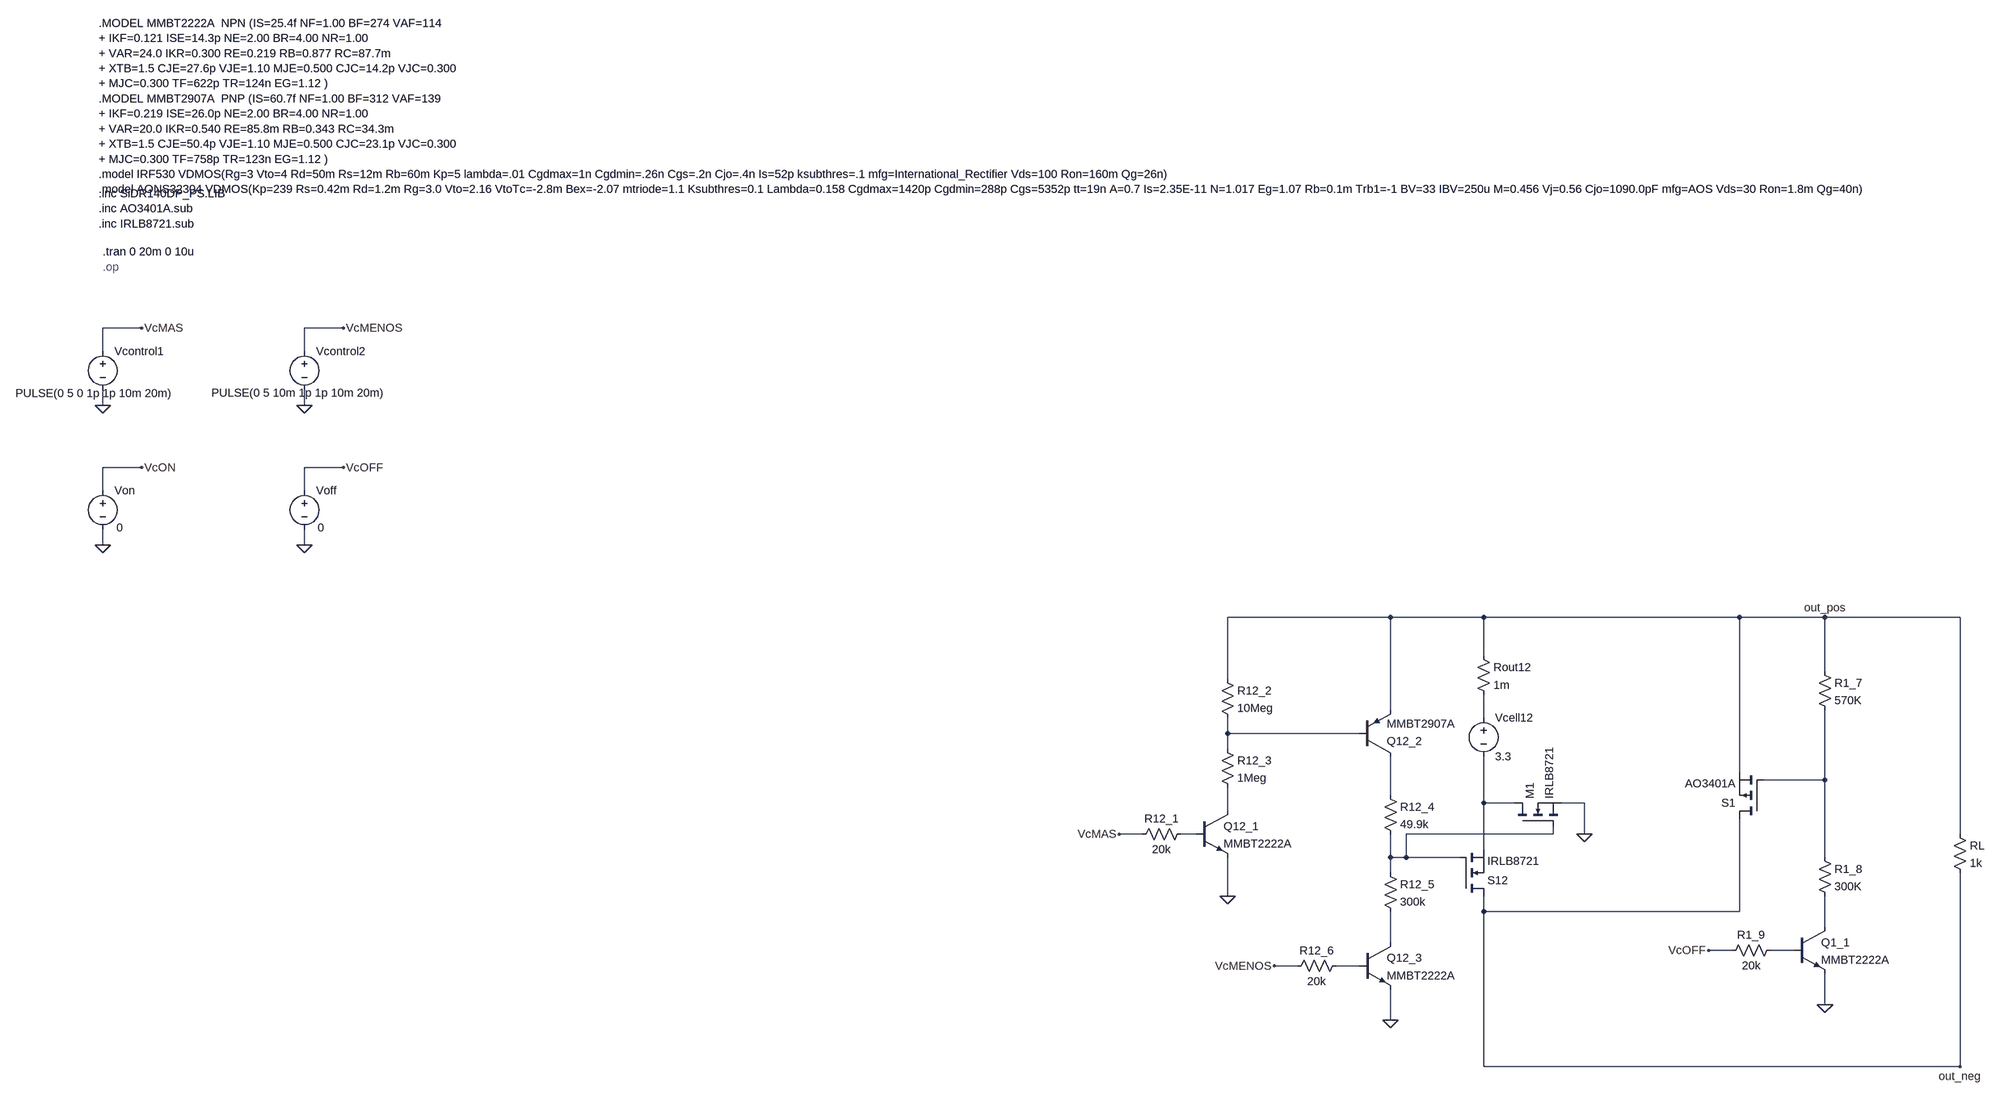
[diagram p0: schematic version1.9.asc]
version1.9.asc, the LTspice schematic file:
Version 4.1
SHEET 1 3872 1360
WIRE -2048 -1040 -2128 -1040
WIRE -1632 -1040 -1712 -1040
WIRE -2128 -992 -2128 -1040
WIRE -1712 -992 -1712 -1040
WIRE -2128 -880 -2128 -912
WIRE -1712 -880 -1712 -912
WIRE -2048 -752 -2128 -752
WIRE -1632 -752 -1712 -752
WIRE -2128 -704 -2128 -752
WIRE -1712 -704 -1712 -752
WIRE -2128 -592 -2128 -624
WIRE -1712 -592 -1712 -624
WIRE 528 -368 192 -368
WIRE 720 -368 528 -368
WIRE 1248 -368 720 -368
WIRE 1424 -368 1248 -368
WIRE 1776 -368 1424 -368
WIRE 720 -288 720 -368
WIRE 1424 -256 1424 -368
WIRE 192 -240 192 -368
WIRE 528 -176 528 -368
WIRE 720 -160 720 -208
WIRE 192 -128 192 -160
WIRE 464 -128 192 -128
WIRE 192 -96 192 -128
WIRE 1248 -48 1248 -368
WIRE 1424 -32 1424 -176
WIRE 1424 -32 1296 -32
WIRE 528 0 528 -80
WIRE 720 16 720 -80
WIRE 784 16 720 16
WIRE 928 16 880 16
WIRE 192 32 192 -16
WIRE 16 80 -32 80
WIRE 128 80 96 80
WIRE 864 80 864 64
WIRE 864 80 560 80
WIRE 928 80 928 16
WIRE 1776 80 1776 -368
WIRE 720 112 720 16
WIRE 528 128 528 80
WIRE 560 128 560 80
WIRE 560 128 528 128
WIRE 672 128 560 128
WIRE 1424 128 1424 -32
WIRE 528 160 528 128
WIRE 192 208 192 128
WIRE 720 240 720 208
WIRE 1248 240 1248 48
WIRE 1248 240 720 240
WIRE 1424 272 1424 208
WIRE 528 304 528 240
WIRE 1232 320 1184 320
WIRE 1360 320 1312 320
WIRE 336 352 288 352
WIRE 464 352 416 352
WIRE 1424 432 1424 368
WIRE 528 464 528 400
WIRE 720 560 720 240
WIRE 1776 560 1776 160
WIRE 1776 560 720 560
FLAG 192 208 0
FLAG 528 464 0
FLAG 928 80 0
FLAG -2128 -880 0
FLAG -1712 -880 0
FLAG -2048 -1040 VcMAS
FLAG -1632 -1040 VcMENOS
FLAG -1712 -592 0
FLAG -1632 -752 VcOFF
FLAG -2128 -592 0
FLAG -2048 -752 VcON
FLAG 288 352 VcMENOS
FLAG -32 80 VcMAS
FLAG 1424 -368 out_pos
FLAG 1776 560 out_neg
FLAG 1424 432 0
FLAG 1184 320 VcOFF
SYMBOL npn 464 304 R0
SYMATTR InstName Q12_3
SYMATTR Value MMBT2222A
SYMBOL res 512 144 R0
SYMATTR InstName R12_5
SYMATTR Value 300k
SYMBOL res 512 -16 R0
SYMATTR InstName R12_4
SYMATTR Value 49.9k
SYMBOL npn 128 32 R0
SYMATTR InstName Q12_1
SYMATTR Value MMBT2222A
SYMBOL res 176 -112 R0
SYMATTR InstName R12_3
SYMATTR Value 1Meg
SYMBOL res 176 -256 R0
SYMATTR InstName R12_2
SYMATTR Value 10Meg
SYMBOL res 432 336 R90
WINDOW 0 0 56 VBottom 2
WINDOW 3 32 56 VTop 2
SYMATTR InstName R12_6
SYMATTR Value 20k
SYMBOL voltage 720 -176 R0
WINDOW 123 0 0 Left 0
WINDOW 39 0 0 Left 0
SYMATTR InstName Vcell12
SYMATTR Value 3.3
SYMBOL pnp 464 -80 M180
SYMATTR InstName Q12_2
SYMATTR Value MMBT2907A
SYMBOL nmos 672 208 M180
SYMATTR InstName S12
SYMATTR Value IRLB8721
SYMATTR Prefix X
SYMBOL voltage -2128 -1008 R0
WINDOW 3 -180 103 Left 2
WINDOW 123 0 0 Left 0
WINDOW 39 0 0 Left 0
SYMATTR Value PULSE(0 5 0 1p 1p 10m 20m)
SYMATTR InstName Vcontrol1
SYMBOL voltage -1712 -1008 R0
WINDOW 3 -192 102 Left 2
WINDOW 123 0 0 Left 0
WINDOW 39 0 0 Left 0
SYMATTR Value PULSE(0 5 10m 1p 1p 10m 20m)
SYMATTR InstName Vcontrol2
SYMBOL voltage -1712 -720 R0
WINDOW 3 27 92 Left 2
WINDOW 123 0 0 Left 0
WINDOW 39 0 0 Left 0
SYMATTR Value 0
SYMATTR InstName Voff
SYMBOL voltage -2128 -720 R0
WINDOW 3 28 92 Left 2
WINDOW 123 0 0 Left 0
WINDOW 39 0 0 Left 0
SYMATTR Value 0
SYMATTR InstName Von
SYMBOL res 112 64 R90
WINDOW 0 0 56 VBottom 2
WINDOW 3 32 56 VTop 2
SYMATTR InstName R12_1
SYMATTR Value 20k
SYMBOL res 1760 64 R0
SYMATTR InstName RL
SYMATTR Value 1k
SYMBOL res 704 -304 R0
SYMATTR InstName Rout12
SYMATTR Value 1m
SYMBOL npn 1360 272 R0
SYMATTR InstName Q1_1
SYMATTR Value MMBT2222A
SYMBOL res 1328 304 R90
WINDOW 0 0 56 VBottom 2
WINDOW 3 32 56 VTop 2
SYMATTR InstName R1_9
SYMATTR Value 20k
SYMBOL res 1408 112 R0
SYMATTR InstName R1_8
SYMATTR Value 300K
SYMBOL res 1408 -272 R0
SYMATTR InstName R1_7
SYMATTR Value 570K
SYMBOL pmos 1296 48 R180
SYMATTR InstName S1
SYMATTR Value AO3401A
SYMATTR Prefix X
SYMBOL nmos 784 64 R270
SYMATTR InstName M1
SYMATTR Value IRLB8721
SYMATTR Prefix x
TEXT -2128 -1336 Left 2 !.tran 0 20m 0 10u
TEXT -2136 -1808 Left 2 !.MODEL MMBT2222A  NPN (IS=25.4f NF=1.00 BF=274 VAF=114 \n+ IKF=0.121 ISE=14.3p NE=2.00 BR=4.00 NR=1.00 \n+ VAR=24.0 IKR=0.300 RE=0.219 RB=0.877 RC=87.7m \n+ XTB=1.5 CJE=27.6p VJE=1.10 MJE=0.500 CJC=14.2p VJC=0.300 \n+ MJC=0.300 TF=622p TR=124n EG=1.12 )\n.MODEL MMBT2907A  PNP (IS=60.7f NF=1.00 BF=312 VAF=139 \n+ IKF=0.219 ISE=26.0p NE=2.00 BR=4.00 NR=1.00 \n+ VAR=20.0 IKR=0.540 RE=85.8m RB=0.343 RC=34.3m \n+ XTB=1.5 CJE=50.4p VJE=1.10 MJE=0.500 CJC=23.1p VJC=0.300 \n+ MJC=0.300 TF=758p TR=123n EG=1.12 )\n.model IRF530 VDMOS(Rg=3 Vto=4 Rd=50m Rs=12m Rb=60m Kp=5 lambda=.01 Cgdmax=1n Cgdmin=.26n Cgs=.2n Cjo=.4n Is=52p ksubthres=.1 mfg=International_Rectifier Vds=100 Ron=160m Qg=26n)\n.model AONS32304 VDMOS(Kp=239 Rs=0.42m Rd=1.2m Rg=3.0 Vto=2.16 VtoTc=-2.8m Bex=-2.07 mtriode=1.1 Ksubthres=0.1 Lambda=0.158 Cgdmax=1420p Cgdmin=288p Cgs=5352p tt=19n A=0.7 Is=2.35E-11 N=1.017 Eg=1.07 Rb=0.1m Trb1=-1 BV=33 IBV=250u M=0.456 Vj=0.56 Cjo=1090.0pF mfg=AOS Vds=30 Ron=1.8m Qg=40n)
TEXT -2136 -1456 Left 2 !.inc SiDR140DP_PS.LIB\n.inc AO3401A.sub\n.inc IRLB8721.sub
TEXT -2128 -1304 Left 2 ;.op

The netlist it stands for:
* version1.9.asc
Q12_3 N010 N012 0 0 MMBT2222A
R12_5 N008 N010 300k
R12_4 N004 N008 49.9k
Q12_1 N006 N007 0 0 MMBT2222A
R12_3 N002 N006 1Meg
R12_2 out_pos N002 10Meg
R12_6 N012 VcMENOS 20k
Vcell12 N001 N005 3.3
Q12_2 N004 N002 out_pos 0 MMBT2907A
X§S12 out_neg N008 N005 IRLB8721  ; pins D G S
Vcontrol1 VcMAS 0 PULSE(0 5 0 1p 1p 10m 20m)
Vcontrol2 VcMENOS 0 PULSE(0 5 10m 1p 1p 10m 20m)
Voff VcOFF 0 0
Von VcON 0 0
R12_1 N007 VcMAS 20k
RL out_pos out_neg 1k
Rout12 out_pos N001 1m
Q1_1 N009 N011 0 0 MMBT2222A
R1_9 N011 VcOFF 20k
R1_8 N003 N009 300K
R1_7 out_pos N003 570K
X§S1 out_neg N003 out_pos AO3401A  ; pins D G S
X§M1 N005 N008 0 IRLB8721  ; pins D G S
.model NPN NPN
.model PNP PNP
.lib standard.bjt
.tran 0 20m 0 10u
.MODEL MMBT2222A  NPN (IS=25.4f NF=1.00 BF=274 VAF=114
+ IKF=0.121 ISE=14.3p NE=2.00 BR=4.00 NR=1.00
+ VAR=24.0 IKR=0.300 RE=0.219 RB=0.877 RC=87.7m
+ XTB=1.5 CJE=27.6p VJE=1.10 MJE=0.500 CJC=14.2p VJC=0.300
+ MJC=0.300 TF=622p TR=124n EG=1.12 )
.MODEL MMBT2907A  PNP (IS=60.7f NF=1.00 BF=312 VAF=139
+ IKF=0.219 ISE=26.0p NE=2.00 BR=4.00 NR=1.00
+ VAR=20.0 IKR=0.540 RE=85.8m RB=0.343 RC=34.3m
+ XTB=1.5 CJE=50.4p VJE=1.10 MJE=0.500 CJC=23.1p VJC=0.300
+ MJC=0.300 TF=758p TR=123n EG=1.12 )
.model IRF530 VDMOS(Rg=3 Vto=4 Rd=50m Rs=12m Rb=60m Kp=5 lambda=.01 Cgdmax=1n Cgdmin=.26n Cgs=.2n Cjo=.4n Is=52p ksubthres=.1 mfg=International_Rectifier Vds=100 Ron=160m Qg=26n)
.model AONS32304 VDMOS(Kp=239 Rs=0.42m Rd=1.2m Rg=3.0 Vto=2.16 VtoTc=-2.8m Bex=-2.07 mtriode=1.1 Ksubthres=0.1 Lambda=0.158 Cgdmax=1420p Cgdmin=288p Cgs=5352p tt=19n A=0.7 Is=2.35E-11 N=1.017 Eg=1.07 Rb=0.1m Trb1=-1 BV=33 IBV=250u M=0.456 Vj=0.56 Cjo=1090.0pF mfg=AOS Vds=30 Ron=1.8m Qg=40n)
.inc SiDR140DP_PS.LIB
.inc AO3401A.sub
.inc IRLB8721.sub
* .op
.backanno
.end